# Altium schematic sheet pa-2g.SchDoc
size Letter; CompanyName: Signal Laboratories, Inc.; Address1: 3479 Edison Way; Address2: Menlo Park CA 94025; Address3: +1 (877) 778-8435; Address4: siglabs.com; Revision: 1; SheetNumber: 1; SheetTotal: 1
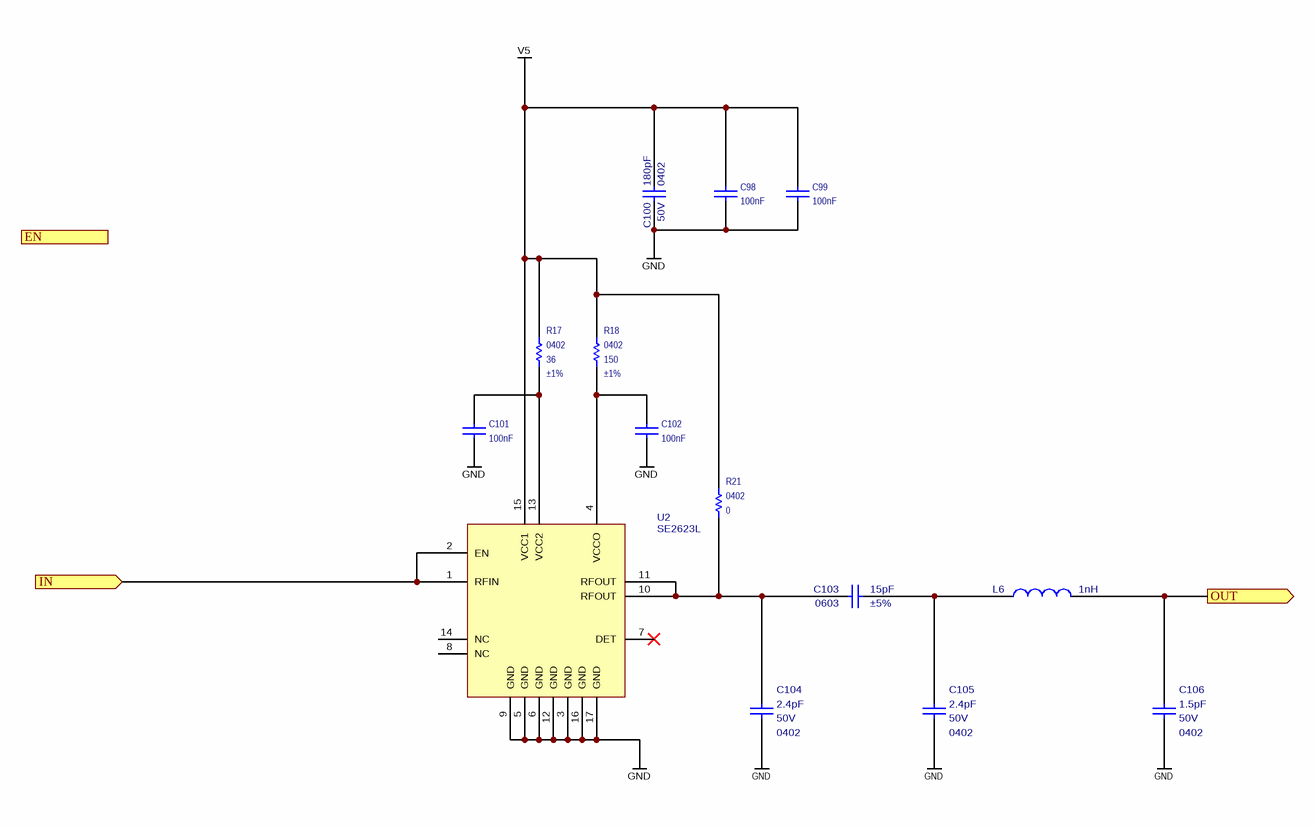
[diagram p0: pa-2g.SchDoc]

## Parts
C98  value 100nF  [CAPC100X50X55L25N]  (hidden comment: GRM155R71C104KA88J)
C99  value 100nF  [CAPC100X50X55L25N]  (hidden comment: GRM155R71C104KA88J)
C100  value 180pF  Package: 0402  Voltage: 50V  [CAPC160X80X90L20N]  (hidden comment: VJ0402A181JNAAJ)
C101  value 100nF  [CAPC100X50X55L25N]  (hidden comment: GRM155R71C104KA88J)
C102  value 100nF  [CAPC100X50X55L25N]  (hidden comment: GRM155R71C104KA88J)
C103  value 15pF  Tolerance: ±5%  Package: 0603  [CAPC160X80X90L20N]  (hidden comment: GQM1885C1H150JB01D)
C104  value 2.4pF  Package: 0402  Voltage: 50V  [CAPC100X50X55L25N]  (hidden comment: VJ0402D2R4BXA)
C105  value 2.4pF  Package: 0402  Voltage: 50V  [CAPC100X50X55L25N]  (hidden comment: VJ0402D2R4BXA)
C106  value 1.5pF  Package: 0402  Voltage: 50V  [CAPC100X50X55L25N]  (hidden comment: VJ0402D1R5BXA)
L6  value 1nH  [INDC1005X55N]  (hidden comment: LQG15HS8N2H02D)
R17  value 36  Tolerance: ±1%  Package: 0402  [RESC1005X40N]  (hidden comment: ERJ-2RKF36R0X)
R18  value 150  Tolerance: ±1%  Package: 0402  [RESC1005X40N]  (hidden comment: ERJ-2RKF1500X)
R21  value 0  Package: 0402  [RESC1005X40N]  (hidden comment: ERJ-2GE0R00X)
U2  SE2623L  [SE2623L]

## Ports
EN (in), IN (in), OUT (out)

## Nets
GND: C98.1 C99.1 C100.1 C101.1 C102.1 C104.2 C105.2 C106.2 U2.3(GND) U2.5(GND) U2.6(GND) U2.9(GND) U2.12(GND) U2.16(GND) U2.17(GND)
V5: C98.2 C99.2 C100.2 R17.2 R18.2 R21.2 U2.15(VCC1)
IN: U2.1(RFIN) U2.2(EN) ; port IN
OUT: C106.1 L6.2 ; port OUT
NetC101_2: C101.2 R17.1 U2.13(VCC2)
NetC102_2: C102.2 R18.1 U2.4(VCCO)
NetC103_1: C103.1 C104.1 R21.1 U2.10(RFOUT) U2.11(RFOUT)
NetC103_2: C103.2 C105.1 L6.1

Not connected (* = marked no-connect by the designer): U2 7(DET)* 8(NC) 14(NC)

## Notes on the sheet
- Title
- Engineer
- Revision
- Drawn By
- Checked By
- Date
- Sheet
- of

## Library data of the parts
C98 C99 C101 C102 = CAP 0402: Ceramic Capacitor 100nF ±10% 16V X7R 0402; Manufacturer: Murata; Tr: -55:125; Voltage: 16V; Manufacturer P/N: GRM155R71C104KA88J; Package: 0402; Tolerance: ±10%
C100 = VJ0402A100JXA: Ceramic Capacitor 180pF ±5% 50V C0G 0402; Manufacturer: Vishay; Tr: -55:150; pF: 180; Manufacturer P/N: VJ0402A181JNAAJ; Tolerance: ±5%
C103 = CAP: Ceramic Capacitor 15pF ±5% NP0 0603; Manufacturer: Murata; Voltage: 50V; Tr: -55"125; Manufacturer P/N: GQM1885C1H150JB01D
C104 C105 = VJ0402A2R2BXA: Ceramic Capacitor 2.4pF ±0.1pF 50V C0G 0402; Manufacturer: Vishay; Tr: -55:150; Manufacturer P/N: VJ0402D2R4BXA; Tolerance: ±0.1pF
C106 = VJ0402A2R2BXA: Ceramic Capacitor 1.5pF ±0.1pF 50V C0G 0402; Manufacturer: Vishay; Tr: -55:150; Manufacturer P/N: VJ0402D1R5BXA; Tolerance: ±0.1pF
L6 = INDUCTOR: Inductor 1nH ±0.3nH 1A; Manufacturer P/N: LQG15HS1N0S02D; Manufacturer: Murata
R17 = RES: Thin Film Resistor 36 +/-1% SMD 0402; Manufacturer: Panasoinc; Tr: -55:155; Power: 0.063W; Tcr: *; Manufacturer P/N: ERJ-2RKF36R0X; Alternatives: *; Voltage: *
R18 = RES: Thin Film Resistor 150 +/-1% SMD 0402; Manufacturer: Panasoinc; Tr: -55:155; Power: 0.063W; Tcr: *; Manufacturer P/N: ERJ-2RKF1500X; Alternatives: *; Voltage: *
R21 = RES: Thin Film Resistor 0 +/-1% SMD 0402; Manufacturer: Panasoinc; Tr: -55:155; Power: 0.063W; Tcr: *; Manufacturer P/N: ERJ-2GE0R00X; Alternatives: *; Voltage: *
U2 = SE2623L: 2.4 GHz, 33dB Power Amplifier